# Altium schematic sheet MezzanineDCDC_Overall.SchDoc: Mezzanine DCDC PCB Overall
size B; Date: 9/7/2021; Engineer: J. Juneau; DocumentNumber: 1006; Revision: 1.2; SheetNumber: 1; SheetTotal: 4
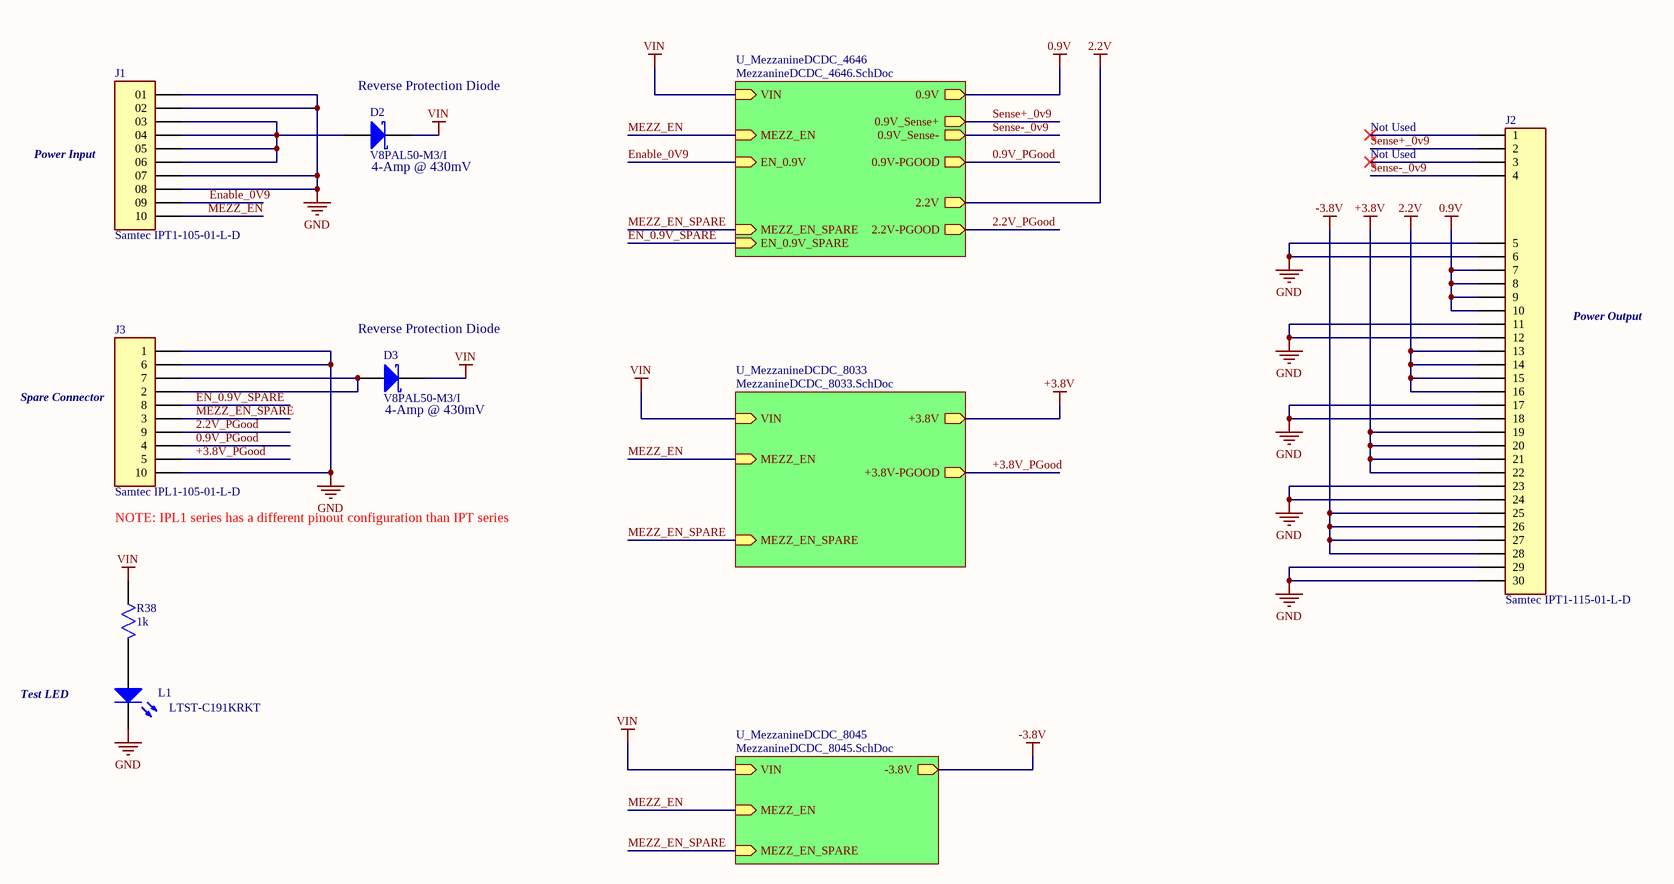
[diagram p0: MezzanineDCDC_Overall.SchDoc]

## Parts
D2  V8PAL50-M3/I  [Schottky Diode V8PAL50-M3/I]
D3  V8PAL50-M3/I  [Schottky Diode V8PAL50-M3/I]
J1  Samtec IPT1-105-01-L-D  [SAMTEC_IPT1-105-01-L-D]
J2  Samtec IPT1-115-01-L-D  [IPT1-115-01-L-D]
J3  Samtec IPL1-105-01-L-D  [IPL1-105-01-L-D]
L1  LTST-C191KRKT  [LED]
R38  value 1k  [Resistor ERJ2G/CRCW 0402]  (hidden comment: ERJ-2GEJ102X)

## Sub-sheets
U_MezzanineDCDC_4646 = MezzanineDCDC_4646.SchDoc: 0.9V (out), VIN (in), 2.2V-PGOOD (out), 2.2V (out), MEZZ_EN (in), EN_0.9V (in), 0.9V_Sense+ (out), 0.9V-PGOOD (out), 0.9V_Sense- (out), MEZZ_EN_SPARE (in), EN_0.9V_SPARE (in)
U_MezzanineDCDC_8033 = MezzanineDCDC_8033.SchDoc: MEZZ_EN (in), VIN (in), +3.8V-PGOOD (out), +3.8V (out), MEZZ_EN_SPARE (in)
U_MezzanineDCDC_8045 = MezzanineDCDC_8045.SchDoc: -3.8V (out), VIN (in), MEZZ_EN (in), MEZZ_EN_SPARE (in)

## Nets
0.9V: J2.7 J2.8 J2.9 J2.10 ; sheet U_MezzanineDCDC_4646/0.9V
2.2V: J2.13 J2.14 J2.15 J2.16 ; sheet U_MezzanineDCDC_4646/2.2V
+3.8V: J2.19 J2.20 J2.21 J2.22 ; sheet U_MezzanineDCDC_8033/+3.8V
-3.8V: J2.25 J2.26 J2.27 J2.28 ; sheet U_MezzanineDCDC_8045/-3.8V
GND: J1.01 J1.02 J1.07 J1.08 J2.5 J2.6 J2.11 J2.12 J2.17 J2.18 J2.23 J2.24 J2.29 J2.30 J3.1 J3.6 J3.10 L1.2(K)
VIN: D2.1(K) D3.1(K) R38.1 ; sheet U_MezzanineDCDC_8033/VIN, sheet U_MezzanineDCDC_8045/VIN, sheet U_MezzanineDCDC_4646/VIN
0.9V_PGood: J3.4 ; sheet U_MezzanineDCDC_4646/0.9V-PGOOD
2.2V_PGood: J3.9 ; sheet U_MezzanineDCDC_4646/2.2V-PGOOD
+3.8V_PGood: J3.5 ; sheet U_MezzanineDCDC_8033/+3.8V-PGOOD
EN_0.9V_SPARE: J3.8 ; sheet U_MezzanineDCDC_4646/EN_0.9V_SPARE
Enable_0V9: J1.09 ; sheet U_MezzanineDCDC_4646/EN_0.9V
MEZZ_EN: J1.10 ; sheet U_MezzanineDCDC_8033/MEZZ_EN, sheet U_MezzanineDCDC_8045/MEZZ_EN, sheet U_MezzanineDCDC_4646/MEZZ_EN
MEZZ_EN_SPARE: J3.3 ; sheet U_MezzanineDCDC_8033/MEZZ_EN_SPARE, sheet U_MezzanineDCDC_8045/MEZZ_EN_SPARE, sheet U_MezzanineDCDC_4646/MEZZ_EN_SPARE
Sense+_0v9: J2.2 ; sheet U_MezzanineDCDC_4646/0.9V_Sense+
Sense-_0v9: J2.4 ; sheet U_MezzanineDCDC_4646/0.9V_Sense-
NetD2_2: D2.2(A) J1.03 J1.04 J1.05 J1.06
NetD3_2: D3.2(A) J3.2 J3.7
NetL1_1: L1.1(A) R38.2

Not connected (* = marked no-connect by the designer): J2 1* 3*

## Notes on the sheet
- (near D2) Reverse Protection Diode
- Power Input
- (near D2) 4-Amp @ 430mV
- Not Used
- Power Output
- (near D3) Reverse Protection Diode
- (near J3) Spare Connector
- (near D3) 4-Amp @ 430mV
- (near J3) NOTE: IPL1 series has a different pinout configuration than IPT series
- Test LED
- Revision Notes:
- Title
- Size:
- Date:
- B
- Engineer:
- Number:
- Revision:
- Sheet
- of
- Electronics Development Group
- LSU Physics and Astronomy
- 133 Nicholson Hall
- Baton Rouge, LA 70803
- File:

## Library data of the parts
D2 D3 = Schotkky Diode: Diode Schottky 50V 4A Surface Mount DO-221BC (SMPA); ComponentLink1Description: Digikey; ComponentLink1URL: https://www.digikey.com/en/products/detail/vishay-general-semiconductor-diodes-division/V8PAL50-M3-I/4580781
J1 = Samtec IPT1-105-01-L-D: CONN HEADER VERT 10POS 2.54MM; ComponentLink1Description: Digikey; ComponentLink1URL: https://www.digikey.com/en/products/detail/samtec-inc/IPT1-105-01-L-D/6561590
J2 = Samtec IPT1-115-01-L-D: 15x2 Pin Connector CONN HEADER VERT 30POS 2.54MM; ComponentLink1Description: Digikey; ComponentLink1URL: https://www.digikey.com/en/products/detail/samtec-inc/IPT1-115-01-L-D/6693479
J3 = Samtec IPL1-105-01-L-D: 5x2 Pin connector; ComponentLink1Description: Samtec; ComponentLink1URL: https://www.samtec.com/products/ipl1
L1 = LED: Red 631nm LED Indication - Discrete 2V 0603 (1608 Metric); ComponentLink1Description: Digikey; ComponentLink1URL: https://www.digikey.com/en/products/detail/lite-on-inc/LTST-C191KRKT/386837?s=N4IgTCBcDaIDIBUDKCC0BhAjATkwaQCU8EQBdAXyA
R38 = ERJ2G Resistor 0402: RES SMD 1K OHM 5% 1/10W 0402; ComponentLink1Description: Digikey; ComponentLink1URL: https://www.digikey.com/en/products/detail/panasonic-electronic-components/ERJ-2GEJ102X/146898?s=N4IgTCBcDaIKICUBSBaMBxOSCMAGMAGiALoC%2BQA